# EAGLE design demeter_v25 (EAGLE 6.2)
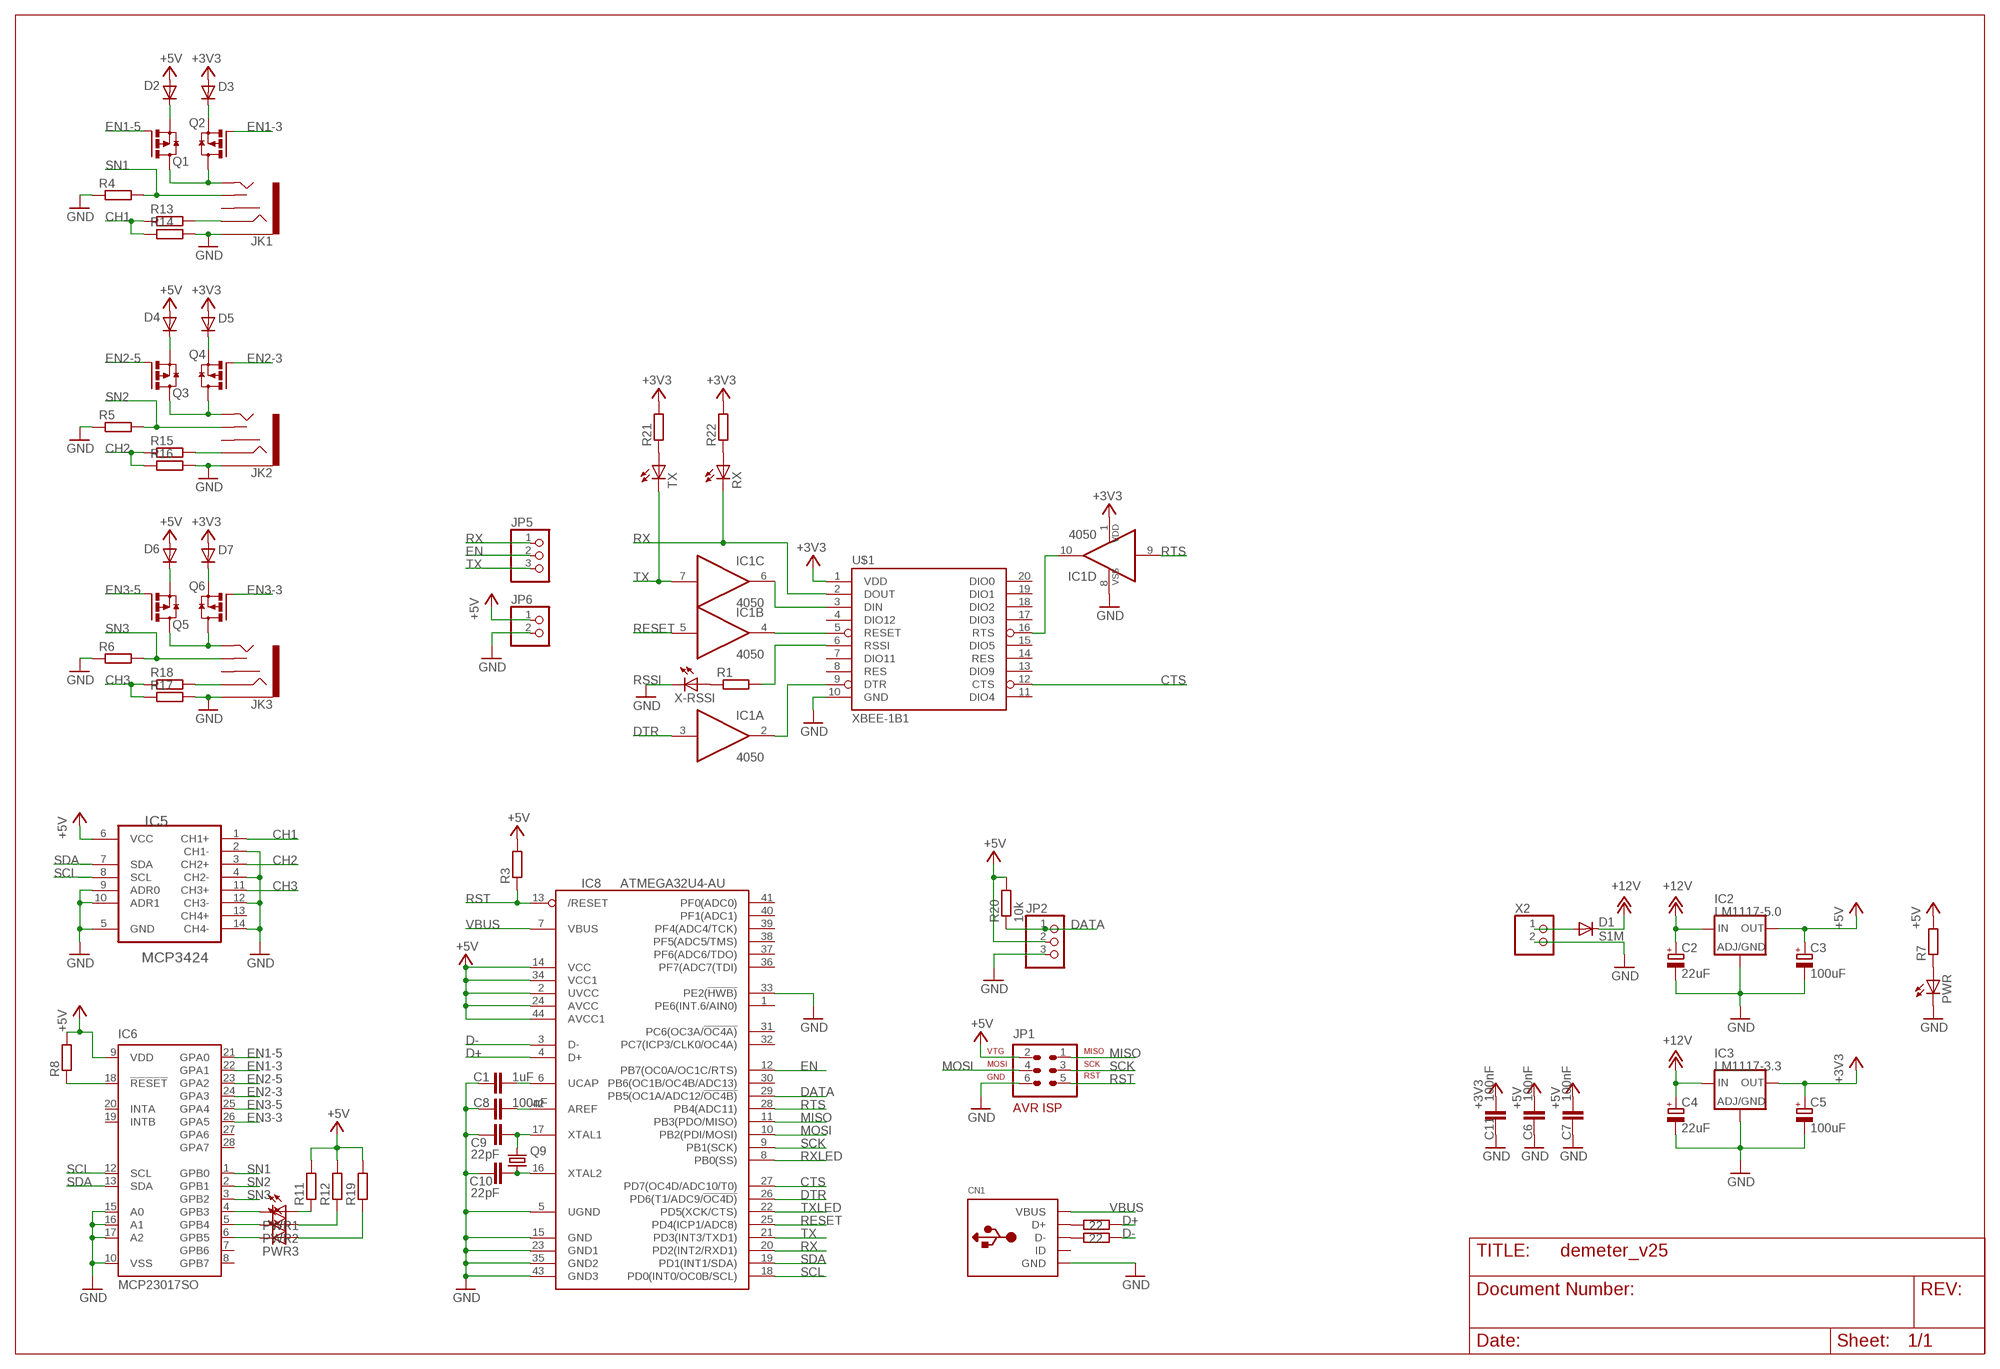
[diagram p0: schematic, sheet 1]

## Parts
C1  1uF  C-EUC0805K  [C0805K]
C2  22uF  CPOL-EUPD  [PANASONIC_D]
C3  100uF  CPOL-EUPD  [PANASONIC_D]
C4  22uF  CPOL-EUPD  [PANASONIC_D]
C5  100uF  CPOL-EUPD  [PANASONIC_D]
C6  100nF  C-EUC0805K  [C0805K]
C7  100nF  C-EUC0805K  [C0805K]
C8  100nF  C-EUC0805K  [C0805K]
C9  22pF  C-EUC0805K  [C0805K]
C10  22pF  C-EUC0805K  [C0805K]
C11  100nF  C-EUC0805K  [C0805K]
CN1  USBMINIB  [USB-MINIB]
D1  S1M  [DO-214AC]
D2  MBR0520  [SOD123]
D3  MBR0520  [SOD123]
D4  MBR0520  [SOD123]
D5  MBR0520  [SOD123]
D6  MBR0520  [SOD123]
D7  MBR0520  [SOD123]
IC1  4050  4050D  [SO16]
IC2  LM1117-5.0  LM1117DT  [DPACK]
IC3  LM1117-3.3  LM1117DT  [DPACK]
IC5  MCP3424  [SO14]
IC6  MCP23017SO  [SO28W]
IC8  ATMEGA32U4-AU  [TQFP44]
JK1  AUDIO-JACK2PTH  [AUDIO-JACK]
JK2  AUDIO-JACK2PTH  [AUDIO-JACK]
JK3  AUDIO-JACK2PTH  [AUDIO-JACK]
JP1  AVR-ISP-6  [AVR-ISP-6]
JP2  PINHD-1X3180  [1X03]
JP5  PINHD-1X3180  [1X03]
JP6  PINHD-1X2  [1X02]
PWR  LED0805  [CHIP-LED0805]
PWR1  LED0805  [CHIP-LED0805]
PWR2  LED0805  [CHIP-LED0805]
PWR3  LED0805  [CHIP-LED0805]
Q1  IRLML6402  [SOT23]
Q2  IRLML6402  [SOT23]
Q3  IRLML6402  [SOT23]
Q4  IRLML6402  [SOT23]
Q5  IRLML6402  [SOT23]
Q6  IRLML6402  [SOT23]
Q9  CRYSTALHC49UP  [HC49UP]
R1  R-EU_R0805  [R0805]
R3  R-EU_R0805  [R0805]
R4  R-EU_R0805  [R0805]
R5  R-EU_R0805  [R0805]
R6  R-EU_R0805  [R0805]
R7  R-EU_R0805  [R0805]
R8  R-EU_R0805  [R0805]
R9  22  R-EU_R0805  [R0805]
R10  22  R-EU_R0805  [R0805]
R11  R-EU_R0805  [R0805]
R12  R-EU_R0805  [R0805]
R13  R-EU_R0805  [R0805]
R14  R-EU_R0805  [R0805]
R15  R-EU_R0805  [R0805]
R16  R-EU_R0805  [R0805]
R17  R-EU_R0805  [R0805]
R18  R-EU_R0805  [R0805]
R19  R-EU_R0805  [R0805]
R20  10k  R-EU_R0805  [R0805]
R21  R-EU_R0805  [R0805]
R22  R-EU_R0805  [R0805]
RX  LED0805  [CHIP-LED0805]
TX  LED0805  [CHIP-LED0805]
U$1  XBEE-1B1  [XBEE-1]
X2  W237-102  [W237-102]
X-RSSI  LED0805  [CHIP-LED0805]

## Nets
+3V3: C5.+ C11.1 D3.A D5.A D7.A IC1.1(P:VDD) IC3.4(OUT) R21.2 R22.2 U$1.1(VDD)
+5V: C3.+ C6.1 C7.1 D2.A D4.A D6.A IC2.4(OUT) IC5.6(VCC) IC6.9(VDD) IC8.2(UVCC) IC8.14(VCC) IC8.24(AVCC) IC8.34(VCC1) IC8.44(AVCC1) JP1.2(VTG) JP2.2 JP6.1 R3.2 R7.2 R8.2 R11.2 R12.2 R19.2 R20.2
+12V: C2.+ C4.+ D1.C IC2.3(IN) IC3.3(IN)
CH1: IC5.1(CH1+) R13.1 R14.1
CH2: IC5.3(CH2+) R15.1 R16.1
CH3: IC5.11(CH3+) R17.1 R18.1
CTS: IC8.27(PD7(OC4D/ADC10/T0)) U$1.12(CTS)
D+: IC8.4(D+) R9.1
D-: IC8.3(D-) R10.1
DATA: IC8.29(PB5(OC1A/ADC12/!OC4B)) JP2.1 R20.1
DTR: IC1.3(A:I) IC8.26(PD6(T1/ADC9/!OC4D))
EN: IC8.12(PB7(OC0A/OC1C/RTS)) JP5.2
EN1-3: IC6.22(GPA1) Q2.1(G)
EN1-5: IC6.21(GPA0) Q1.1(G)
EN2-3: IC6.24(GPA3) Q4.1(G)
EN2-5: IC6.23(GPA2) Q3.1(G)
EN3-3: IC6.26(GPA5) Q6.1(G)
EN3-5: IC6.25(GPA4) Q5.1(G)
GND: C1.2 C2.- C3.- C4.- C5.- C6.2 C7.2 C8.2 C9.2 C10.2 C11.2 CN1.GND IC1.8(P:VSS) IC2.1(ADJ) IC3.1(ADJ) IC5.2(CH1-) IC5.4(CH2-) IC5.5(GND) IC5.9(ADR0) IC5.10(ADR1) IC5.12(CH3-) IC5.14(CH4-) IC6.10(VSS) IC6.15(A0) IC6.16(A1) IC6.17(A2) IC8.5(UGND) IC8.15(GND) IC8.23(GND1) IC8.33(PE2(!HWB)) IC8.35(GND2) IC8.43(GND3) JK1.SLEEVE JK2.SLEEVE JK3.SLEEVE JP1.6(GND) JP2.3 JP6.2 PWR.C R4.1 R5.1 R6.1 R14.2 R16.2 R17.2 U$1.10(GND) X2.2 X-RSSI.C
MISO: IC8.11(PB3(PDO/MISO)) JP1.1(MISO)
MOSI: IC8.10(PB2(PDI/MOSI)) JP1.4(MOSI)
N$1: D1.A X2.1
N$2: PWR.A R7.1
N$3: IC1.6(C:O) U$1.3(DIN)
N$4: IC1.4(B:O) U$1.5(RESET)
N$5: PWR1.A R11.1
N$6: R1.1 X-RSSI.A
N$7: IC1.2(A:O) U$1.9(DTR)
N$8: IC1.10(D:O) U$1.16(RTS)
N$11: IC6.18(!RESET) R8.1
N$12: JK1.TIP Q1.3(D) Q2.3(D)
N$13: D2.C Q1.2(S)
N$14: D3.C Q2.2(S)
N$15: JK2.TIP Q3.3(D) Q4.3(D)
N$16: D4.C Q3.2(S)
N$17: D5.C Q4.2(S)
N$18: JK3.TIP Q5.3(D) Q6.3(D)
N$19: D6.C Q5.2(S)
N$20: D7.C Q6.2(S)
N$22: PWR2.A R12.1
N$23: PWR3.A R19.1
N$24: C1.1 IC8.6(UCAP)
N$25: C8.1 IC8.42(AREF)
N$26: C9.1 IC8.17(XTAL1) Q9.2
N$27: C10.1 IC8.16(XTAL2) Q9.1
N$28: CN1.D+ R9.2
N$29: CN1.D- R10.2
N$30: JK1.RING R13.2
N$31: IC6.6(GPB5) PWR3.C
N$32: JK2.RING R15.2
N$33: IC6.5(GPB4) PWR2.C
N$34: JK3.RING R18.2
N$35: IC6.4(GPB3) PWR1.C
N$36: R21.1 TX.A
N$37: R22.1 RX.A
RESET: IC1.5(B:I) IC8.25(PD4(ICP1/ADC8))
RSSI: R1.2 U$1.6(RSSI)
RST: IC8.13(/RESET) JP1.5(RST) R3.1
RTS: IC1.9(D:I) IC8.28(PB4(ADC11))
RX: IC8.20(PD2(INT2/RXD1)) JP5.1 RX.C U$1.2(DOUT)
RXLED: IC8.8(PB0(SS))
SCK: IC8.9(PB1(SCK)) JP1.3(SCK)
SCL: IC5.8(SCL) IC6.12(SCL) IC8.18(PD0(INT0/OC0B/SCL))
SDA: IC5.7(SDA) IC6.13(SDA) IC8.19(PD1(INT1/SDA))
SN1: IC6.1(GPB0) JK1.TSH R4.2
SN2: IC6.2(GPB1) JK2.TSH R5.2
SN3: IC6.3(GPB2) JK3.TSH R6.2
TX: IC1.7(C:I) IC8.21(PD3(INT3/TXD1)) JP5.3 TX.C
TXLED: IC8.22(PD5(XCK/CTS))
VBUS: CN1.VBUS IC8.7(VBUS)
Unconnected: CN1.ID IC1.11(E:I) IC1.12(E:O) IC1.14(F:I) IC1.15(F:O) IC5.13(CH4+) IC6.7(GPB6) IC6.8(GPB7) IC6.19(INTB) IC6.20(INTA) IC6.27(GPA6) IC6.28(GPA7) IC8.1(PE6(INT.6/AIN0)) IC8.30(PB6(OC1B/OC4B/ADC13)) IC8.31(PC6(OC3A/!OC4A)) IC8.32(PC7(ICP3/CLK0/OC4A)) IC8.36(PF7(ADC7(TDI)) IC8.37(PF6(ADC6/TDO)) IC8.38(PF5(ADC5/TMS)) IC8.39(PF4(ADC4/TCK)) IC8.40(PF1(ADC1)) IC8.41(PF0(ADC0)) JK1.RSH JK2.RSH JK3.RSH U$1.4(DIO12) U$1.7(DIO11) U$1.8(RES) U$1.11(DIO4) U$1.13(DIO9) U$1.14(RES) U$1.15(DIO5) U$1.17(DIO3) U$1.18(DIO2) U$1.19(DIO1) U$1.20(DIO0)

## Library data of the parts
C1 C6-C11 = mark_2:C-EU: CAPACITOR, European symbol
C2-C5 = mark_2:CPOL-EU: POLARIZED CAPACITOR, European symbol
CN1 = mark_2:USB: USB Connectors USBMINIB - Surface Mount Female Mini-B USB Connector 4UConnector: 06564 By microbuilder.eu Thru-hole RA Female Mini-B USB Connector 4UConnector: 18732 By ladyada.net
D1 = mark_2:S1M
D2-D7 = mark_2:MBR0520: SCHOTTKY BARRIER RECTIFIER Source: http://onsemi.com .. MBR0520LT1-D.pdf
IC1 = mark_2:4050: Hex non-inverting BUFFER
IC2 IC3 = mark_2:LM1117: Low drop fixed and adjustable positive voltage regulators 1 A Source: http://www.st.com/stonline/products/literature/ds/7194/ld1117axx.pdf
IC5 = mark_2:MCP3424: Analog-to-Digital Converter; MPN: MCP3424-E/SL; OC_FARNELL: 1630424; OC_NEWARK: 54M4871; PACKAGE: SOIC-14; SUPPLIER: Microchip
IC6 = mark_2:MCP23017: http://ww1.microchip.com/downloads/en/DeviceDoc/21952a.pdf Source: http://ww1.microchip.com/downloads/en/DeviceDoc/21952a.pdf; MF: MICROCHIP; MPN: MCP23017-E/SO; OC_FARNELL: 1332087; OC_NEWARK: 31K2958
IC8 = mark_2:ATMEGA32U4: http://www.ladyada.net/library/eagle
JK1-JK3 = mark_2:AUDIO-JACK2
JP1 = mark_2:AVR-ISP-6: AVR ISP-6 Serial Programming Header
JP2 JP5 = mark_2:PINHD-1X3: PIN HEADER
JP6 = mark_2:PINHD-1X2: PIN HEADER
PWR PWR1-PWR3 RX TX X-RSSI = mark_2:LED
Q1-Q6 = mark_2:IRLML6402: Single P-Channe MOSFET
Q9 = mark_2:CRYSTAL: CRYSTAL
R1 R3-R22 = mark_2:R-EU_: RESISTOR, European symbol
U$1 = mark_2:XBEE-1
X2 = mark_2:W237-102: WAGO SCREW CLAMP

## Board
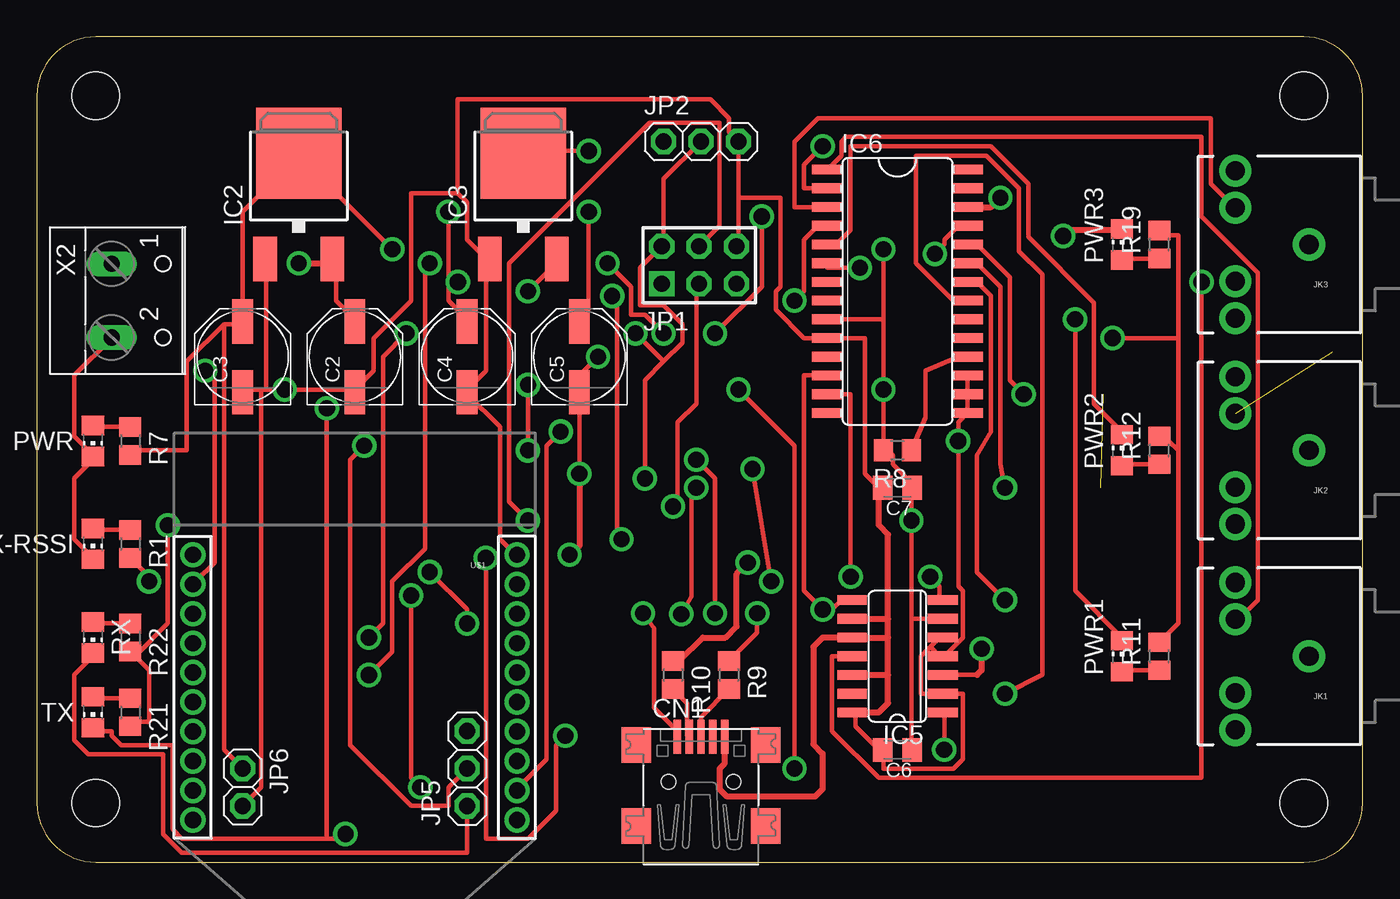
[diagram p1: board, top side]
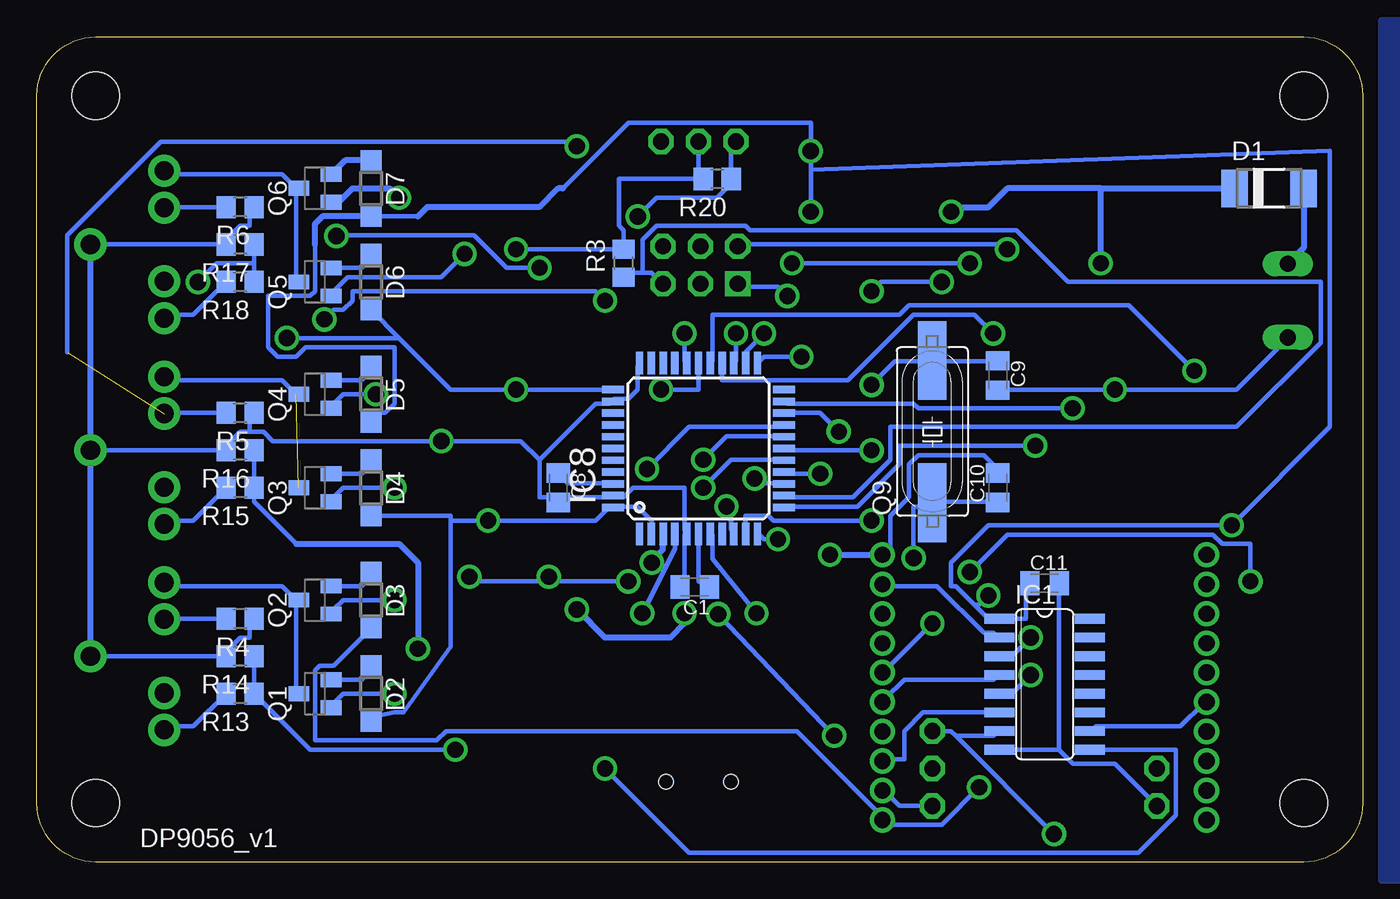
[diagram p2: board, bottom side, seen from below]

Size 90 x 56 mm. Coordinates in mm from the lower left corner, seen from the top.
Copper layers (1*16): Top 0.035mm / dielectric 1.5mm / Bottom 0.035mm
Design rules: minimum track width 12mil, minimum drill 1.1mm, track to track 8mil, track to pad 8mil, pad to pad 8mil, via to via 8mil, smd to smd 8mil, copper to edge 10mil, drill to drill 8mil, minimum pad ring 12mil, minimum via ring 10mil, stop-mask expansion 4mil, vias tented up to drill 25mil, thermal gap 10mil

### Footprints (pad centres in the part's own frame; a part is rotated, then mirrored left to right if it is on the bottom)
C0805K = smd 1.3 x 1.6: 1 -1,0; 2 1,0
PANASONIC_D = smd 3 x 1.4: + 2.4,0; - -2.4,0
USB-MINIB = smd 0.5 x 2.308: D+ 0,4.064; D- -0.8,4.064; GND 1.6,4.064; ID 0.8,4.064; VBUS -1.6,4.064 | smd 2 x 2.4: GND1 -4.4,-2; GND2 -4.4,3.5; GND3 4.4,3.5; GND4 4.4,-2 | hole 1: -2.2,1; 2.2,1
DO-214AC = smd 1.778 x 2.54: A 2.342,0; C -2.342,0
SOD123 = smd 1.4 x 1.4: A 1.9,0; C -1.9,0
SO16 = smd 0.66 x 2.032: 1 -4.445,-3.073; 2 -3.175,-3.073; 3 -1.905,-3.073; 4 -0.635,-3.073; 5 0.635,-3.073; 6 1.905,-3.073; 7 3.175,-3.073; 8 4.445,-3.073; 9 4.445,3.073; 10 3.175,3.073; 11 1.905,3.073; 12 0.635,3.073; 13 -0.635,3.073; 14 -1.905,3.073; 15 -3.175,3.073; 16 -4.445,3.073
DPACK = smd 1.6 x 3: 1 -2.28,-4.8; 3 2.28,-4.8 | smd 5.8 x 6.2: 4 0,2.38
SO14 = smd 2.032 x 0.66: 1 -3.073,3.81; 2 -3.073,2.54; 3 -3.073,1.27; 4 -3.073,0; 5 -3.073,-1.27; 6 -3.073,-2.54; 7 -3.073,-3.81; 8 3.073,-3.81; 9 3.073,-2.54; 10 3.073,-1.27; 11 3.073,0; 12 3.073,1.27; 13 3.073,2.54; 14 3.073,3.81
SO28W = smd 0.66 x 2.032: 1 -7.62,-4.78; 2 -6.35,-4.78; 3 -5.08,-4.78; 4 -3.81,-4.78; 5 -2.54,-4.78; 6 -1.27,-4.78; 7 0,-4.78; 8 1.27,-4.78; 9 2.54,-4.78; 10 3.81,-4.78; 11 5.08,-4.78; 12 6.35,-4.78; 13 7.62,-4.78; 14 8.89,-4.78; 15 8.89,4.78; 16 7.62,4.78; 17 6.35,4.78; 18 5.08,4.78; 19 3.81,4.78; 20 2.54,4.78; 21 1.27,4.78; 22 0,4.78; 23 -1.27,4.78; 24 -2.54,4.78; 25 -3.81,4.78; 26 -5.08,4.78; 27 -6.35,4.78; 28 -7.62,4.78
TQFP44 = smd 1.5 x 0.5: 1 -5.8,4; 2 -5.8,3.2; 3 -5.8,2.4; 4 -5.8,1.6; 5 -5.8,0.8; 6 -5.8,0; 7 -5.8,-0.8; 8 -5.8,-1.6; 9 -5.8,-2.4; 10 -5.8,-3.2; 11 -5.8,-4; 23 5.8,-4; 24 5.8,-3.2; 25 5.8,-2.4; 26 5.8,-1.6; 27 5.8,-0.8; 28 5.8,0; 29 5.8,0.8; 30 5.8,1.6; 31 5.8,2.4; 32 5.8,3.2; 33 5.8,4 | smd 0.5 x 1.5: 12 -4,-5.8; 13 -3.2,-5.8; 14 -2.4,-5.8; 15 -1.6,-5.8; 16 -0.8,-5.8; 17 0,-5.8; 18 0.8,-5.8; 19 1.6,-5.8; 20 2.4,-5.8; 21 3.2,-5.8; 22 4,-5.8; 34 4,5.8; 35 3.2,5.8; 36 2.4,5.8; 37 1.6,5.8; 38 0.8,5.8; 39 0,5.8; 40 -0.8,5.8; 41 -1.6,5.8; 42 -2.4,5.8; 43 -3.2,5.8; 44 -4,5.8
AUDIO-JACK = drill 1.3 pad 2.184: RING 5,5; RSH 5,2.5; SLEEVE 0,0; TIP 5,-5; TSH 5,-2.5
AVR-ISP-6 = drill 1.1 square: 1 -2.54,-1.27 | drill 1.1 octagon: 2 -2.54,1.27; 3 0,-1.27; 4 0,1.27; 5 2.54,-1.27; 6 2.54,1.27
1X03 = drill 1.1 octagon: 1 -2.54,0; 2 0,0; 3 2.54,0
1X02 = drill 1.1 octagon: 1 -1.27,0; 2 1.27,0
CHIP-LED0805 = smd 1.5 x 1.3: A 0,-1.05; C 0,1.05
SOT23 = smd 1 x 1.4: 1 -0.95,-1.1; 2 0.95,-1.1; 3 0,1.1
HC49UP = smd 5.334 x 1.93: 1 -4.826,0; 2 4.826,0
R0805 = smd 1.3 x 1.5: 1 -0.95,0; 2 0.95,0
XBEE-1 = drill 1.1: 1 -11,20; 2 -11,18; 3 -11,16; 4 -11,14; 5 -11,12; 6 -11,10; 7 -11,8; 8 -11,6; 9 -11,4; 10 -11,2; 11 11,2; 12 11,4; 13 11,6; 14 11,8; 15 11,10; 16 11,12; 17 11,14; 18 11,16; 19 11,18; 20 11,20
DP9056_V1 = hole 3.2: 4,4; 86,4; 86,52; 4,52
W237-102 = drill 1.1 long: 1 -2.5,-1.27; 2 2.5,-1.27

### Placement (x,y rotation side)
C1  45.34,18.67 180 bottom
C2  21.59,34.29 90 top
C3  13.97,34.29 90 top
C4  29.21,34.29 90 top
C5  36.83,34.29 90 top
C6  58.42,7.62 180 top
C7  58.42,25.4 180 top
C8  54.61,25.4 270 bottom
C9  24.77,33.02 270 bottom
C10  24.77,25.4 90 bottom
C11  21.59,18.92 0 bottom
CN1  45.08,4.45 0 top
D1  6.35,45.72 0 bottom
D2  67.31,11.43 270 bottom
D3  67.31,17.78 270 bottom
D4  67.31,25.4 270 bottom
D5  67.31,31.75 270 bottom
D6  67.31,39.37 270 bottom
D7  67.31,45.72 270 bottom
IC1  21.59,12.07 270 bottom
IC2  17.78,45.72 0 top
IC3  33.02,45.72 0 top
IC5  58.42,13.97 180 top
IC6  58.42,39.37 270 top
IC8  45.08,28.07 90 bottom
JK1  86.36,13.97 180 top
JK2  86.36,27.94 180 top
JK3  86.36,41.91 180 top
JP1  44.96,40.51 0 top
JP2  45.08,48.89 0 top
JP5  29.21,6.35 90 top
JP6  13.97,5.08 270 top
PWR  3.81,28.57 180 top
PWR1  73.66,13.97 0 top
PWR2  73.66,27.94 0 top
PWR3  73.66,41.91 0 top
Q1  71.12,11.43 90 bottom
Q2  71.12,17.78 90 bottom
Q3  71.12,25.4 90 bottom
Q4  71.12,31.75 90 bottom
Q5  71.12,39.37 90 bottom
Q6  71.12,45.72 90 bottom
Q9  29.21,29.21 90 bottom
R1  6.35,21.59 270 top
R3  50.16,40.64 90 bottom
R4  76.2,16.51 180 bottom
R5  76.2,30.48 180 bottom
R6  76.2,44.45 180 bottom
R7  6.35,28.57 270 top
R8  58.42,27.94 180 top
R9  46.99,12.7 270 top
R10  43.18,12.7 270 top
R11  76.2,13.97 90 top
R12  76.2,27.94 90 top
R13  76.2,11.43 180 bottom
R14  76.2,13.97 180 bottom
R15  76.2,25.4 180 bottom
R16  76.2,27.94 180 bottom
R17  76.2,41.91 180 bottom
R18  76.2,39.37 180 bottom
R19  76.2,41.91 90 top
R20  43.81,46.35 180 bottom
R21  6.35,10.16 270 top
R22  6.35,15.24 270 top
RX  3.81,15.24 180 top
TX  3.81,10.16 180 top
U$1  21.59,22.86 180 top
U$6  [DP9056_V1]  0,0 0 top
X2  6.35,38.1 270 top
X-RSSI  3.81,21.59 180 top

### Tracks (layer width: path | path; a pad name or v marks a point on that pad's centre or on a via)
+3V3  (via drill 1.1)
  Top 0.305: 6.67,13.97 R22.2 6.67,13.97 | 6.67,13.97 7.62,13.02 7.62,9.53 6.35,9.53 R21.2 | 6.67,13.97 8.89,16.19 v8.89,22.86 | v37.46,44.13 37.46,37.46 36.83,36.83 C5.+ | v37.46,48.26 33.02,48.26 IC3.4 | v26.04,5.08 25.4,5.71 v25.4,18.1
  Bottom 0.305: D3.A 69.85,13.34 70.8,13.34 71.12,13.02 71.12,8.26 62.87,8.26 62.23,8.89 38.42,8.89 32.7,3.18 U$1.1 32.38,2.86 32.07,2.54 28.57,2.54 v26.04,5.08 | C11.1 22.86,18.73 22.86,16.51 IC1.1 25.4,16.51 26.35,17.46 | 26.35,17.46 27.62,18.73 27.94,18.73 27.94,20.32 25.4,22.86 v8.89,22.86 2.22,29.53 2.22,48.26 37.46,46.99 | 71.12,41.91 71.12,38.73 71.44,38.42 74.3,38.42 74.3,34.92 73.66,34.29 72.39,34.29 71.76,34.92 65.72,34.92 65.72,31.11 66.36,30.48 66.99,30.48 67.31,30.16 D5.A | 64.14,43.81 D7.A | 37.46,46.99 v37.46,48.26 37.46,50.16 49.85,50.16 54.29,45.72 | 37.46,46.99 v37.46,44.13 | v25.4,18.1 26.04,17.46 26.35,17.46
  Bottom 0.406: 54.29,45.72 54.61,45.72 55.88,44.45 63.5,44.45 64.14,43.81 | D7.A 70.61,43.82 71.12,43.31 71.12,41.91
+5V  (via drill 1.1)
  Top 0.305: 12.7,36.51 10.16,33.97 10.16,27.94 6.35,27.94 R7.2 | 12.7,36.51 13.97,36.51 C3.+ 13.97,44.13 17.78,47.94 | JP6.1 12.7,7.62 12.7,36.51 | v41.27,26.04 41.27,32.7 42.54,33.97 | 42.54,33.97 43.81,35.24 43.81,36.51 42.54,37.78 40.96,37.78 40.96,40.32 JP1.2 42.54,41.91 42.54,46.35 JP2.2 | 42.54,33.97 v40.64,35.88 | 77.47,27.94 77.47,16.19 R11.2 | 77.47,27.94 76.84,28.57 76.2,28.57 R12.2 | 77.47,27.94 77.47,35.56 | 77.47,35.56 77.47,42.54 76.2,42.54 R19.2 | 59.37,25.4 59.37,25.72 58.1,26.99 58.1,27.62 57.78,27.94 R8.2 v57.47,32.07 57.47,36.83 | 59.37,25.4 v59.37,23.18 59.37,16.51 | 59.37,16.51 59.37,7.62 C6.1 | 59.37,25.4 C7.1 | 57.47,36.83 IC6.9 | 59.37,16.51 IC5.6 | v73.03,35.56 77.47,35.56 | 57.47,36.83 v57.47,41.59 | v24.13,41.59 17.78,47.94 | 17.78,47.94 IC2.4
  Bottom 0.305: R3.2 50.16,42.86 50.48,43.18 50.48,46.35 45.08,46.35 | 45.08,46.35 R20.2 | 45.08,46.35 JP2.2 | v41.27,26.04 40.96,25.72 39.37,25.72 IC8.14 | v40.64,35.88 41.91,34.61 41.91,33.97 IC8.24 | IC8.2 48.26,22.54 48.26,23.18 49.21,24.13 50.8,24.13 IC8.44 51.12,24.13 52.07,23.18 v59.37,23.18 61.91,23.18 | 61.91,23.18 61.91,23.5 D4.A | 61.91,23.18 61.91,14.61 65.09,10.16 65.72,10.16 67.31,9.84 D2.A | 65.41,35.56 61.91,32.07 v57.47,32.07 51.12,32.07 IC8.34 | 65.41,35.56 D6.A | 65.41,35.56 v73.03,35.56 | v57.47,41.59 R3.2 | R3.2 | v24.13,41.59 24.45,41.91 42.23,41.91 JP1.2
+12V  (via drill 1.1)
  Top 0.305: 20,40.96 IC2.3 20.32,40.64 20.32,38.1 21.59,36.83 C2.+ | v27.94,44.13 27.94,39.37 | 27.94,39.37 27.94,38.1 29.21,36.83 C4.+ | v33.34,38.73 35.24,40.64 IC3.3 | 27.94,39.37 v28.57,39.37
  Top 0.406: v17.78,40.64 19.78,40.64 IC2.3
  Bottom 0.305: v33.34,38.73 32.7,39.37 v28.57,39.37
  Bottom 0.406: v17.78,40.64 17.78,45.72 | 17.78,45.72 D1.C | v27.94,44.13 27.94,44.45 25.4,44.45 24.13,45.72 17.78,45.72
CH1  (via drill 1.1)
  Top 0.305: v61.59,7.62 61.59,10.16 IC5.1
  Bottom 0.305: R13.1 R14.1 | v61.59,7.62 71.44,7.62 R13.1 | R13.1
CH2  (via drill 1.1)
  Top 0.305: 63.82,12.7 IC5.3
  Top 0.406: v64.14,14.48 64.14,13.02 63.82,12.7
  Bottom 0.305: R15.1 R16.1 | 72.39,21.59 75.25,24.45 R15.1 | R15.1
  Bottom 0.406: 72.39,21.59 65.41,21.59 64.14,20.32 v64.14,14.48
CH3  (via drill 1.1)
  Top 0.305: IC5.11 53.97,13.97 53.97,8.89 57.15,5.71 79.06,5.71 v79.06,39.37
  Bottom 0.305: 75.25,40.64 R17.1 | 75.25,40.64 R18.1 | v79.06,39.37 77.79,40.64 75.25,40.64
CTS  (via drill 1.1)
  Top 0.305: v11.43,33.34 12.07,32.7 12.07,20.32 10.79,19.05 U$1.12
  Bottom 0.305: v11.43,33.34 15.88,37.78 30.8,37.78 31.43,37.15 44.13,37.15 44.13,33.97 IC8.27
D+  (via drill 1.1)
  Top 0.305: v48.89,16.89 48.89,15.56 R9.1
  Bottom 0.305: v48.89,16.89 46.67,21.27 46.67,22.23 IC8.4
D-  (via drill 1.1)
  Top 0.406: R10.1 43.62,13.65 45.21,15.24 46.74,15.24 47.5,16 47.5,19.56 v48.26,20.32
  Bottom 0.406: v48.26,20.32 48.26,20.45 47.5,21.21 47.5,22.25 IC8.3
DATA  (via drill 1.1)
  Top 0.305: v46.04,35.88 49.21,39.05 v49.21,43.81
  Bottom 0.305: JP2.1 42.86,48.89 R20.1 43.18,46.35 43.18,45.72 43.81,45.08 47.94,45.08 v49.21,43.81 | v46.04,35.88 46.04,33.97 IC8.29
DTR  (via drill 1.1)
  Top 0.305: v25.08,35.88 23.5,34.29 23.5,16.19 v22.54,15.24
  Bottom 0.305: v25.08,35.88 26.35,37.15 30.48,37.15 34.92,32.7 43.5,32.7 43.5,33.65 IC8.26 | v22.54,15.24 23.81,13.97 IC1.3
EN  (via drill 1.1)
  Top 0.305: v22.23,28.26 21.27,27.3 21.27,7.94 25.4,3.81 27.94,3.81 27.94,5.08 JP5.2
  Bottom 0.305: v22.23,28.26 31.43,28.26 31.43,26.99 34.29,24.13 39.05,24.13 IC8.12
EN1-3  (via drill 1.1)
  Top 0.305: v65.72,17.78 63.82,19.68 63.82,27.62 64.77,29.21 64.77,38.42 63.82,39.37 IC6.22
  Bottom 0.305: v65.72,17.78 69.22,17.78 69.85,17.14 Q2.1
EN1-5  (via drill 1.1)
  Top 0.305: v65.72,11.43 68.26,12.7 68.26,39.88 66.67,41.47 66.67,45.72 64.45,47.94 59.69,47.94 59.69,40.64 62.23,38.1 IC6.21
  Bottom 0.305: v65.72,11.43 69.22,11.43 69.85,10.79 Q1.1
EN2-3  (via drill 1.1)
  Top 0.305: v66.99,31.75 66.04,32.7 66.04,39.69 63.82,41.91 IC6.24
  Bottom 0.305: v66.99,31.75 69.22,31.75 69.85,31.11 Q4.1
EN2-5  (via drill 1.1)
  Top 0.305: v65.72,25.4 65.41,26.99 65.41,39.05 63.82,40.64 IC6.23
  Bottom 0.305: v65.72,25.4 69.22,25.4 69.85,24.77 Q3.1
EN3-3  (via drill 1.1)
  Top 0.406: IC6.26 64.77,44.45 v65.41,45.08
  Bottom 0.406: Q6.1 69.53,44.77 68.58,45.72 66.04,45.72 v65.41,45.08
EN3-5  (via drill 1.1)
  Top 0.305: v60.96,41.27 61.59,41.91 61.59,42.23 62.55,43.18 IC6.25
  Bottom 0.305: v60.96,41.27 62.55,39.69 68.9,39.69 69.85,38.73 Q5.1
GND  (via drill 1.1)
  Top 0.305: 63.18,31.75 63.18,30.48 | 63.18,31.75 63.18,33.02 IC6.17 | 63.18,31.75 IC6.16 | 60.64,14.61 61.28,15.24 IC5.5 | 60.64,14.61 60.01,13.97 60.01,11.43 IC5.2 62.87,11.43 62.87,6.99 62.23,6.35 57.47,6.35 57.47,7.62 C6.2 57.15,7.62 55.56,9.21 55.56,10.16 IC5.14 | 60.64,14.61 61.28,13.97 IC5.4 61.59,13.97 62.87,15.24 62.87,18.41 62.55,18.73 v62.55,28.57 62.55,29.84 63.18,30.48 | 63.18,30.48 IC6.15 | 47.62,45.08 JP2.3 46.99,49.53 46.99,50.48 45.72,51.75 28.57,51.75 28.57,45.4 | 47.62,45.08 47.62,41.91 JP1.6 | v36.83,26.35 36.83,26.99 C5.- 36.83,33.02 v38.1,34.29 | 55.56,15.24 IC5.10 | 55.56,16.51 IC5.9 55.24,16.51 | C7.2 57.15,25.4 56.2,26.35 56.2,35.56 IC6.10 52.07,35.56 50.16,37.46 50.16,38.73 50.48,39.05 50.48,45.08 47.62,45.08 | 46.67,8.26 CN1.GND | X-RSSI.C 3.81,20.64 2.54,21.91 2.54,26.04 3.81,27.3 PWR.C 3.81,27.62 2.54,28.89 2.54,33.02 5.08,35.56 X2.2 | U$1.10 32.38,20.96 31.43,21.91 31.43,29.53 29.21,31.75 C4.- 29.21,32.07 30.48,33.34 30.48,40.64 IC3.1 30.48,40.96 29.21,42.23 29.21,44.77 28.57,45.4 | 21.59,32.07 v16.83,32.07 15.56,32.07 | 15.56,32.07 15.24,32.07 | 15.24,32.07 13.97,32.07 C3.- | 15.56,32.07 15.56,40.64 IC2.1 | 15.24,32.07 15.24,5.08 JP6.2 | 28.57,45.4 25.4,45.4 25.4,38.1 22.86,35.56 22.86,33.34 21.59,32.07 | 21.59,32.07 C2.-
  Top 0.406: 55.56,10.16 57.15,10.16 57.78,10.79 57.78,12.7 | 57.78,12.7 57.78,15.24 | 57.78,15.24 57.78,16.51 | 57.78,16.51 57.78,22.23 57.15,22.86 57.15,25.13 C7.2 | IC5.12 57.78,12.7 | IC5.9 57.78,16.51 | 57.78,15.24 IC5.10 53.34,15.24 52.7,14.61 52.7,8 53.34,7.37 53.34,4.95 52.83,4.45 46.86,4.45 46.35,4.95 46.35,6.35 46.67,6.67 46.67,8.26 | 36.83,26.99 36.83,21.46 36.2,20.83 v36.16,20.86
  Bottom 0.305: IC8.33 49.21,33.65 49.21,32.07 49.85,31.43 50.8,31.43 IC8.35 51.12,31.11 52.07,31.11 55.88,27.3 | C1.2 46.04,19.05 46.04,22.23 IC8.5 46.04,22.54 46.04,25.4 49.53,25.4 50.16,24.77 50.8,24.77 IC8.43 51.12,24.77 54.29,24.77 | 54.29,24.77 54.61,24.45 C8.2 54.29,24.77 | 55.88,27.3 55.88,24.77 54.29,24.77 | JK3.SLEEVE 77.47,41.91 | 77.47,41.91 76.2,43.18 75.56,43.18 75.56,44.45 R6.1 | 77.47,41.91 R17.2 | JK1.SLEEVE 77.47,13.97 | 77.47,13.97 76.2,15.24 75.56,15.24 75.56,16.51 R4.1 | 77.47,13.97 R14.2 | JK2.SLEEVE 77.47,27.94 | 75.56,29.21 75.56,30.48 R5.1 | 75.56,29.21 76.2,29.21 77.47,27.94 | 77.47,27.94 R16.2 | 55.88,27.3 57.15,28.57 v62.55,28.57 73.98,28.57 74.61,29.21 75.56,29.21 | v36.83,26.35 39.05,26.35 IC8.15 | v38.1,34.29 40.64,34.29 40.96,33.97 IC8.23 | C9.2 24.77,32.07 v16.83,32.07 8.57,32.07 5.08,35.56 X2.2 | C10.2 24.77,26.67 25.72,27.62 30.16,27.62 30.8,26.99 30.8,24.77 32.07,23.5 32.07,20.96 32.38,20.96 U$1.10 | 20.64,7.62 20.64,18.73 C11.2 | IC1.8 20.64,7.62 | JP6.2 16.83,6.67 19.68,6.67 20.64,7.62
  Bottom 0.406: JK1.SLEEVE JK2.SLEEVE JK3.SLEEVE | v36.16,20.86 U$1.10
  pour Bottom (isolate 0.813): -1.27,57.15 -10.16,57.15 -10.16,-1.27 -1.27,-1.27
MISO  (via drill 1.1)
  Top 0.305: v39.69,21.91 39.37,22.23 39.37,38.1 v39.05,38.42
  Bottom 0.305: v39.69,21.91 40.64,21.91 40.96,22.23 IC8.11 | v39.05,38.42 39.69,39.05 42.23,39.05 JP1.1
MOSI  (via drill 1.1)
  Top 0.305: v33.34,23.18 32.07,24.45 32.07,40.64 41.59,50.16 46.35,50.16 46.35,43.18 JP1.4
  Bottom 0.305: v33.34,23.18 40,23.18 40.32,23.5 41.91,23.5 41.91,22.54 IC8.10
N$1
  Bottom 0.406: D1.A 4.01,41.67 X2.1
N$2
  Top 0.305: PWR.A 3.81,29.53 R7.1
N$3
  Bottom 0.305: IC1.6 29.84,10.16 31.11,8.89 31.11,6.99 32.38,6.99 U$1.3
N$4
  Bottom 0.305: IC1.4 24.77,12.7 25.08,12.38 31.11,12.38 32.38,11.11 U$1.5
N$5
  Top 0.305: PWR1.A 73.66,13.02 R11.1
N$6
  Top 0.305: X-RSSI.A 3.81,22.54 R1.1
N$7
  Bottom 0.305: IC1.2 24.77,15.24 25.08,15.56 25.72,15.56 28.89,18.73 32.38,18.73 U$1.9
N$8
  Bottom 0.305: IC1.10 18.41,8.89 18.1,9.21 12.38,9.21 10.79,10.79 U$1.16
N$11
  Top 0.305: IC6.18 62.55,34.29 60.32,33.34 60.32,30.16 R8.1
N$12
  Bottom 0.305: 72.39,17.78 72.39,11.43 Q1.3 | 72.39,17.78 73.34,18.73 81.28,18.73 JK1.TIP | 72.39,17.78 Q2.3
N$13
  Bottom 0.305: D2.C 67.31,13.02 67.95,12.38 69.85,12.38 Q1.2
N$14
  Bottom 0.305: D3.C 67.31,19.37 67.95,18.73 69.85,18.73 Q2.2
N$15  (1 unrouted)
  Bottom 0.305: Q4.3 72.39,31.75 73.34,32.7 81.28,32.7 JK2.TIP
N$16
  Bottom 0.305: D4.C 67.31,26.99 67.95,26.35 69.85,26.35 Q3.2
N$17
  Bottom 0.305: D5.C 67.31,33.34 67.95,32.7 69.85,32.7 Q4.2
N$18
  Bottom 0.305: 72.39,45.72 72.39,39.37 Q5.3 | 72.39,45.72 73.34,46.67 81.28,46.67 JK3.TIP | 72.39,45.72 Q6.3
N$19
  Bottom 0.305: D6.C 67.31,40.96 67.95,40.32 69.85,40.32 Q5.2
N$20
  Bottom 0.406: D7.C 69.07,47.62 Q6.2
N$22
  Top 0.305: PWR2.A 73.66,26.99 R12.1
N$23
  Top 0.305: PWR3.A 73.66,40.96 R19.1
N$24
  Bottom 0.305: IC8.6 45.08,19.05 C1.1
N$25
  Bottom 0.305: IC8.42 51.12,25.72 53.97,25.72 54.61,26.35 C8.1
N$26  (via drill 1.1)
  Top 0.305: v33.34,32.38 v33.34,27.94
  Bottom 0.305: v33.34,27.94 39.05,27.94 IC8.17 | v33.34,32.38 31.75,33.97 29.21,33.97 | 29.21,33.97 24.77,33.97 C9.1 | 29.21,33.97 Q9.2
N$27  (via drill 1.1)
  Top 0.305: v44.77,25.4 44.45,25.08 44.45,18.03 v43.75,16.83 | v35.88,8.57 35.24,7.94 35.24,3.49 33.34,1.59 30.48,1.59 v30.48,20.64
  Bottom 0.305: v44.77,25.4 42.86,27.3 39.37,27.3 IC8.16 | v35.88,8.57 v43.75,16.83 | v30.48,20.64 30.48,24.13 29.21,24.13 Q9.1 29.21,24.45 24.77,24.45 C10.1
N$28
  Top 0.305: CN1.D+ 45.08,9.84 R9.2
N$29
  Top 0.305: R10.2 44.13,10.79 44.13,8.57 CN1.D-
N$30
  Bottom 0.305: R13.2 79.38,9.21 81.28,9.21 JK1.RING
N$31  (via drill 1.1)
  Top 0.305: v55.88,40.32 53.66,40.32 53.66,40.64 IC6.6 | 73.66,42.86 PWR3.C
  Top 0.406: 73.66,42.86 70.04,42.86 v69.66,42.48
  Bottom 0.305: v69.66,42.48 69.85,42.54 60.32,42.54 58.1,40.32 v55.88,40.32
N$32
  Bottom 0.305: R15.2 79.38,23.18 81.28,23.18 JK2.RING
N$33
  Top 0.305: IC6.5 54.29,41.91 55.24,42.86 55.24,48.58 64.77,48.58 67.31,46.04 67.31,42.42 71.76,37.97 71.76,31.11 73.66,29.21 PWR2.C
N$34
  Bottom 0.305: R18.2 79.38,37.15 81.28,37.15 JK3.RING
N$35  (via drill 1.1)
  Top 0.305: v70.48,36.83 70.48,18.41 73.66,15.24 PWR1.C | v51.43,38.1 52.07,38.73 52.07,42.23 53.02,43.18 IC6.4
  Bottom 0.305: v70.48,36.83 69.85,37.46 69.22,37.46 68.58,38.1 68.58,38.73 52.07,38.73 v51.43,38.1
N$36
  Top 0.305: TX.A 3.81,11.11 R21.1
N$37
  Top 0.305: RX.A 3.81,16.19 R22.1
RESET  (via drill 1.1)
  Top 0.305: v42.54,35.88 41.27,37.15 40.32,37.15 40.32,39.05 v38.73,40.64 | v26.67,40.64 26.35,40.32 26.35,21.27 24.13,19.05 24.13,14.29 v22.54,12.7
  Bottom 0.305: v42.54,35.88 42.54,33.97 IC8.25 | v26.67,40.64 v38.73,40.64 | v22.54,12.7 23.81,11.43 IC1.5
RSSI  (via drill 1.1)
  Top 0.305: v7.62,19.05 7.62,19.37 R1.2 | v26.67,19.68 29.21,17.14 v29.21,16.19
  Bottom 0.305: v7.62,19.05 7.62,21.59 9.53,21.59 10.16,22.23 24.13,22.23 v26.67,19.68 | v29.21,16.19 32.38,13.02 U$1.6
RST
  Bottom 0.305: 48.89,40 48.89,42.23 47.94,43.18 41.91,43.18 41.59,42.86 23.5,42.86 20,39.37 2.86,39.37 2.86,35.24 8.57,29.53 32.07,29.53 32.07,27.3 34.61,24.77 39.05,24.77 IC8.13 | 48.89,40 50.16,40 R3.1 | JP1.5 48.26,40 48.89,40
RTS  (via drill 1.1)
  Top 0.305: v47.62,32.07 51.43,28.26 v51.43,6.35
  Bottom 0.305: IC8.28 45.08,32.07 v47.62,32.07 | v51.43,6.35 45.72,0.64 15.24,0.64 12.7,3.18 12.7,7.62 IC1.9
RX  (via drill 1.1)
  Top 0.305: v35.56,29.21 34.61,28.26 34.61,6.99 32.7,5.08 U$1.2 | JP5.1 29.21,0.64 9.84,0.64 8.57,1.9 8.57,7.3 3.49,7.3 2.54,8.26 2.54,12.7 3.81,13.97 RX.C
  Bottom 0.305: v35.56,29.21 36.83,30.48 39.05,30.48 IC8.20 | JP5.1 31.43,3.81 32.38,4.76 U$1.2
SCK  (via drill 1.1)
  Top 0.305: v43.18,24.13 43.5,24.45 43.5,29.84 44.77,31.11 44.77,39.05 JP1.3
  Bottom 0.305: v43.18,24.13 42.86,24.13 42.86,22.54 IC8.9
SCL  (via drill 1.1)
  Top 0.305: v44.77,27.3 46.04,26.04 v46.04,16.89 | IC5.8 54.61,17.78 53.97,17.14 v53.34,17.14 52.07,18.41 52.07,33.02 IC6.12
  Bottom 0.305: v44.77,27.3 43.18,28.89 39.37,28.89 IC8.18
  Bottom 0.406: v46.04,16.89 46.04,16.19 46.99,15.24 51.43,15.24 v53.34,17.14
SDA  (via drill 1.1)
  Top 0.305: v49.85,19.05 v48.58,26.67 | v60.64,19.37 61.28,18.73 61.28,17.78 IC5.7 | IC6.13 55.24,31.75 v55.24,19.37
  Bottom 0.305: v48.58,26.67 45.72,29.53 39.37,29.53 IC8.19 | 55.24,19.05 60.32,19.05 v60.64,19.37 | 55.24,19.05 v49.85,19.05 | 55.24,19.05 v55.24,19.37
SN1
  Top 0.305: IC6.1 53.66,46.99 54.61,47.94 54.61,48.89 54.93,49.21 79.06,49.21 79.06,43.81 82.87,40 82.87,17.78 81.6,16.51 JK1.TSH
  Bottom 0.305: R4.2 81.28,16.51 JK1.TSH
SN2  (via drill 1.1)  (1 unrouted)
  Top 0.305: IC6.2 52.07,45.72 52.07,47.31 v53.34,48.58
  Bottom 0.305: R5.2 81.28,30.48 JK2.TSH | v53.34,48.58 53.66,48.89 81.6,48.89 87.95,42.54 87.95,34.61
SN3
  Top 0.305: IC6.3 51.43,44.45 51.43,48.89 53.02,50.48 79.69,50.48 79.69,46.04 81.28,44.45 JK3.TSH
  Bottom 0.305: R6.2 81.28,44.45 JK3.TSH
TX  (via drill 1.1)
  Top 0.305: 19.68,1.59 20.96,1.59 v20.96,1.9 | 19.68,1.59 9.84,1.59 9.21,2.22 9.21,7.94 5.71,7.94 5.08,8.57 5.08,8.89 3.81,8.89 TX.C | 19.68,1.59 v19.68,30.8
  Bottom 0.305: 27.62,8.57 27.94,8.89 JP5.3 | 27.62,8.57 v20.96,1.9 | v19.68,30.8 30.16,30.8 30.48,31.11 39.05,31.11 IC8.21 | 27.62,8.57 25.08,8.57 24.77,8.89 IC1.7
VBUS  (via drill 1.1)
  Top 0.305: v41.15,16.89 41.91,15.88 41.91,10.48 43.5,8.89 43.5,8.57 CN1.VBUS
  Bottom 0.305: v41.15,16.89 44.13,20.57 44.13,22.23 IC8.7